# Altium schematic sheet NOR_FLASH.SchDoc
size 420 x 297 mm; SheetNumber: 10; SheetTotal: 13
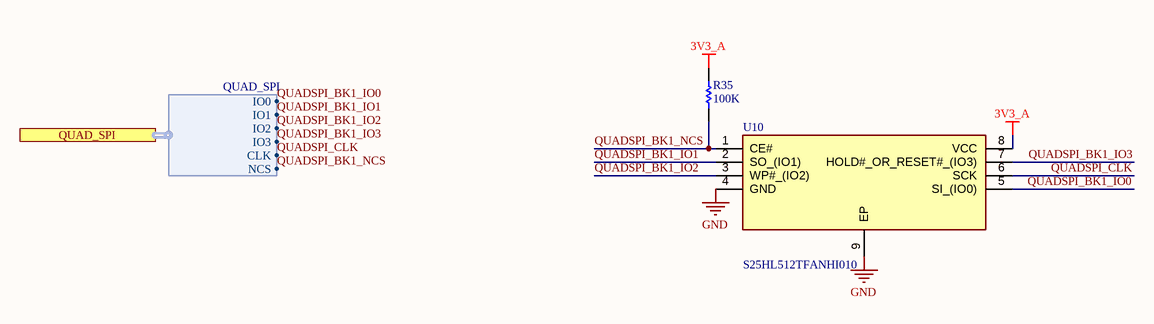
[diagram p0: NOR_FLASH.SchDoc]

## Parts
R35  100K  [RESC1608X55X30ML20T10]
U10  S25HL512TFANHI010  [SON127P800X600X80-9N-D]

## Ports
QUAD_SPI (harness QUAD_SPI)

## Harnesses
QUAD_SPI: IO0, IO1, CLK, NCS, IO2, IO3

## Nets
3V3_A: R35.2 U10.8(VCC)
GND: U10.4(GND) U10.9(EP)
QUADSPI_BK1_IO0: U10.5(SI_(IO0)) ; port QUAD_SPI.IO0
QUADSPI_BK1_IO1: U10.2(SO_(IO1)) ; port QUAD_SPI.IO1
QUADSPI_BK1_IO2: U10.3(WP#_(IO2)) ; port QUAD_SPI.IO2
QUADSPI_BK1_IO3: U10.7(HOLD#_OR_RESET#_(IO3)) ; port QUAD_SPI.IO3
QUADSPI_BK1_NCS: R35.1 U10.1(CE#) ; port QUAD_SPI.NCS
QUADSPI_CLK: U10.6(SCK) ; port QUAD_SPI.CLK

## Notes on the sheet
- THIS DOCUMENT AND THE DATA DISCLOSED HEREIN OR
- HEREWITH IS THE PROPERTY OF ALTIUM LIMITED AND MAY
- DWG NO:
- REVISION
- REV:
- DESCRIPTION
- DATE
- APPROVED
- BE FREELY DISTRIBUTED IN WHOLE. NO RIGHTS ARE
- RESERVED OR EXPRESS OR IMPLIED WARANTEE GIVEN.
- ENG:
- APPROVALS
- PROJECT
- DSN:
- CHK:
- REFERENCE DOCUMENTS
- PROJECT REVISION:
- TITLE
- DOCUMENT REVISION:
- DESIGN ITEM:
- BOM:
- FAB DWG:
- PCB DWG:
- ASSY DWG:
- SCALE:
- A3
- SIZE
- CAGE CODE
- FILE NAME
- DWG NO.
- SHEET
- OF
- REV

## Library data of the parts
R35 = CMP-2000-01852-1: Part Number: RK73B1JTTD104J; Manufacturer: KOA Speer
U10 = S25HL512TFANHI010: Integrated Circuit; Manufacturer_Name: Infineon; Datasheet Link: https://datasheet.datasheetarchive.com/originals/distributors/Datasheets_SAMA/73f7ac27cabd57f4f78d8f5aeecdde91.pdf; Height: 0.8mm; Manufacturer_Part_Number: S25HL512TFANHI010; Mouser Part Number: 727-S25HL512TFANHI01; Mouser Price/Stock: https://www.mouser.co.uk/ProductDetail/Infineon-Technologies/S25HL512TFANHI010?qs=BJlw7L4Cy7%252B6M3sHZp0BRA%3D%3D